# Altium project Kasli-SOC.PrjPcb (part 6 of 11)

## Sheet Kasli-SOC_ClockRecovery.SchDoc: Clock recovery
size 420 x 297 mm; EDA_Number: ARTIQ; Projet: ARTIQ/SINARA; CheckedBy: G.Kasprowicz; Author: F.Switakowski; CompanyName: WUT ISE; DrawnBy: F.Switakowski; Organization: WUT ISE; Address1: PW ISE; Address2: Nowowiejska 15/19 00-665 Warsaw; Address3: gkasprow@gmail.com; DocumentNumber: 12; Revision: 1; SheetNumber: 12; SheetTotal: 18; ModifiedBy: -; CheckedDate: -; Title2: & distribution; DivGrp: WUT ISE; Designer: G.Kasprowicz; ModifiedDate: -; ProjectName: Sensor Box
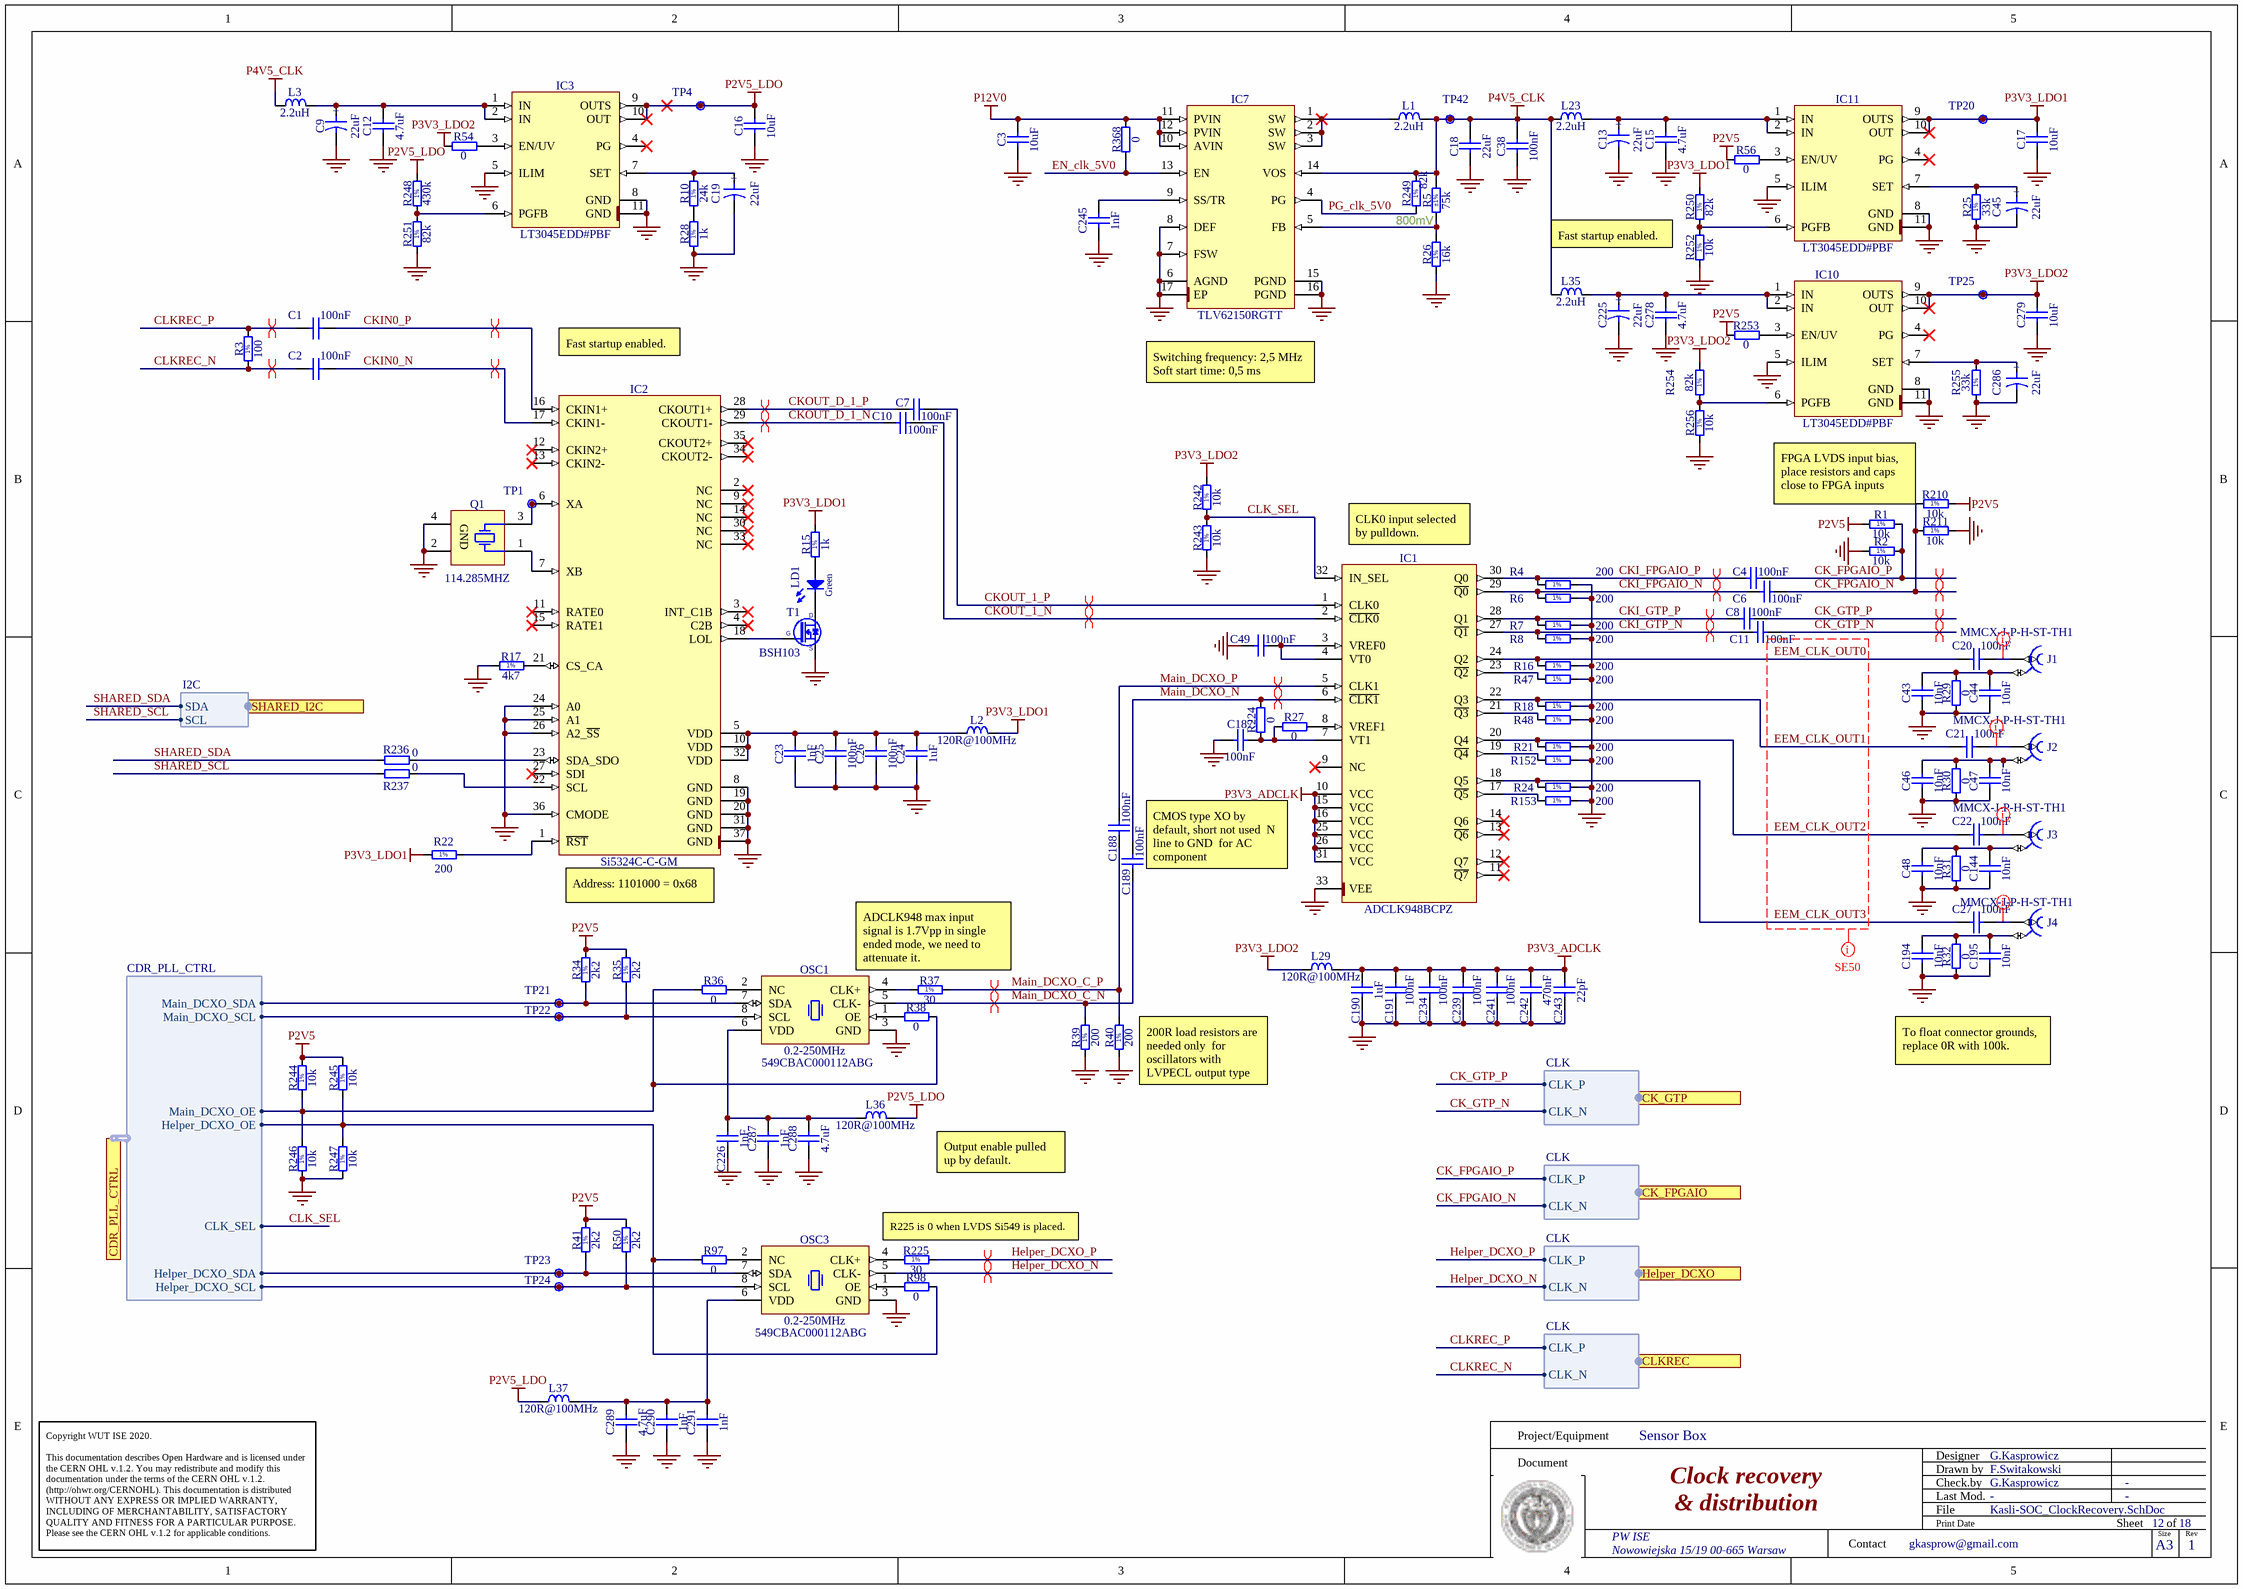
[diagram p11: Kasli-SOC_ClockRecovery.SchDoc]

### Parts
C1  100nF  [CAPC0603X33N]
C2  100nF  [CAPC0603X33N]
C3  10uF  [CAPC1608X80N]
C4  100nF  [CAPC0603X33N]
C6  100nF  [CAPC0603X33N]
C7  100nF  [CAPC0603X33N]
C8  100nF  [CAPC0603X33N]
C9  22uF  [CAPMP3216X180N]
C10  100nF  [CAPC0603X33N]
C11  100nF  [CAPC0603X33N]
C12  4.7uF  [CAPC1005X55N]
C13  22uF  [CAPMP3216X180N]
C15  4.7uF  [CAPC1005X55N]
C16  10uF  [CAPC1005X70N]
C17  10uF  [CAPC1005X70N]
C18  22uF  [CAPC2012X135N]
C19  22uF  [CAPMP3216X180N]
C20  100nF  [CAPC0603X33N]
C21  100nF  [CAPC0603X33N]
C22  100nF  [CAPC0603X33N]
C23  1nF  [CAPC1005X55N]
C24  1uF  [CAPC1005X55N]
C25  100nF  [CAPC1005X55N]
C26  100nF  [CAPC1005X55N]
C27  100nF  [CAPC0603X33N]
C38  100nF  [CAPC1005X55N]
C43  10nF  [CAPC1005X55N]
C44  10nF  [CAPC1005X55N]
C45  22uF  [CAPMP3216X180N]
C46  10nF  [CAPC1005X55N]
C47  10nF  [CAPC1005X55N]
C48  10nF  [CAPC1005X55N]
C49  100nF  [CAPC0603X33N]
C144  10nF  [CAPC1005X55N]
C187  100nF  [CAPC1005X55N]
C188  100nF  [CAPC0603X33N]
C189  100nF  [CAPC0603X33N]
C190  1uF  [CAPC1005X55N]
C191  100nF  [CAPC0603X33N]
C194  10nF  [CAPC1005X55N]
C195  10nF  [CAPC1005X55N]
C225  22uF  [CAPMP3216X180N]
C226  1nF  [CAPC1005X55N]
C234  100nF  [CAPC0603X33N]
C239  100nF  [CAPC0603X33N]
C241  100nF  [CAPC0603X33N]
C242  470nF  [CAPC0603X33N]
C243  22pF  [CAPC1005X55N]
C245  1nF  [CAPC1005X55N]
C278  4.7uF  [CAPC1005X55N]
C279  10uF  [CAPC1005X70N]
C286  22uF  [CAPMP3216X180N]
C287  1nF  [CAPC1005X55N]
C288  4.7uF  [CAPC2012X135N]
C289  4.7uF  [CAPC2012X135N]
C290  1nF  [CAPC1005X55N]
C291  1nF  [CAPC1005X55N]
IC1  ADCLK948BCPZ  [QFN50P500X500X80-33N-S285]
IC2  Si5324C-C-GM  [QFN50P600X600X90-37N-S425]
IC3  LT3045EDD#PBF  [SON50P300X300X80-11N-R175X248]
IC7  TLV62150RGTT  [QFN50P300X300X100-17N-S180]
IC10  LT3045EDD#PBF  [SON50P300X300X80-11N-R175X248]
IC11  LT3045EDD#PBF  [SON50P300X300X80-11N-R175X248]
J1  MMCX-J-P-H-ST-TH1  [SAMTEC_MMCX-J-P-H-ST-TH1]
J2  MMCX-J-P-H-ST-TH1  [SAMTEC_MMCX-J-P-H-ST-TH1]
J3  MMCX-J-P-H-ST-TH1  [SAMTEC_MMCX-J-P-H-ST-TH1]
J4  MMCX-J-P-H-ST-TH1  [SAMTEC_MMCX-J-P-H-ST-TH1]
L1  2.2uH  [IND_WURTH_WE-PMCI_0806LR]
L2  120R@100MHz  [INDC1608X65N]
L3  2.2uH  [IND_WURTH_WE-PMCI_0806LR]
L23  2.2uH  [IND_WURTH_WE-PMCI_0806LR]
L29  120R@100MHz  [INDC1608X65N]
L35  2.2uH  [IND_WURTH_WE-PMCI_0806LR]
L36  120R@100MHz  [INDC1608X65N]
L37  120R@100MHz  [INDC1608X65N]
LD1  Green  [LED_KINGBRIGHT_KPH-1608CGCK]
OSC1  0.2-250MHz  Manufacturer Part Number: 549CBAC000112ABG  [OSC_SILICON-LAB_SI549-A]
OSC3  0.2-250MHz  Manufacturer Part Number: 549CBAC000112ABG  [OSC_SILICON-LAB_SI549-A]
Q1  114.285MHZ  [XTAL_CONNOR_CS]
R1  10k  [RESC1005X40N]
R2  10k  [RESC1005X40N]
R3  100  [RESC1005X40N]
R4  200  [RESC1005X40N]
R5  75k  Tolerance: ±1%  [RESC1005X40N]
R6  200  [RESC1005X40N]
R7  200  [RESC1005X40N]
R8  200  [RESC1005X40N]
R10  24k  [RESC1005X40N]
R15  1k  [RESC1005X40N]
R16  200  [RESC1005X40N]
R17  4k7  [RESC1005X40N]
R18  200  [RESC1005X40N]
R21  200  [RESC1005X40N]
R22  200  [RESC1005X40N]
R24  200  [RESC1005X40N]
R25  33k  [RESC1005X40N]
R26  16k  [RESC1005X40N]
R27  0  [RESC1005X40N]
R28  1k  [RESC1005X40N]
R29  0  [RESC1005X40N]
R30  0  [RESC1005X40N]
R31  0  [RESC1005X40N]
R32  0  [RESC1005X40N]
R34  2k2  [RESC1005X40N]
R35  2k2  [RESC1005X40N]
R36  0  [RESC1005X40N]
R37  30  [RESC1005X40N]
R38  0  [RESC1005X40N]
R39  200  [RESC1005X40N]
R40  200  [RESC1005X40N]
R41  2k2  [RESC1005X40N]
R47  200  [RESC1005X40N]
R48  200  [RESC1005X40N]
R50  2k2  [RESC1005X40N]
R54  0  [RESC1005X40N]
R56  0  [RESC1005X40N]
R97  0  [RESC1005X40N]
R98  0  [RESC1005X40N]
R152  200  [RESC1005X40N]
R153  200  [RESC1005X40N]
R210  10k  [RESC1005X40N]
R211  10k  [RESC1005X40N]
R224  0  [RESC1005X40N]
R225  30  [RESC1005X40N]
R236  0  [RESC1005X40N]
R237  0  [RESC1005X40N]
R242  10k  [RESC1005X40N]
R243  10k  [RESC1005X40N]
R244  10k  [RESC1005X40N]
R245  10k  [RESC1005X40N]
R246  10k  [RESC1005X40N]
R247  10k  [RESC1005X40N]
R248  430k  [RESC1005X40N]
R249  82k  [RESC1005X40N]
R250  82k  [RESC1005X40N]
R251  82k  [RESC1005X40N]
R252  10k  [RESC1005X40N]
R253  0  [RESC1005X40N]
R254  82k  [RESC1005X40N]
R255  33k  [RESC1005X40N]
R256  10k  [RESC1005X40N]
R368  0  [RESC1005X40N]
T1  BSH103  [SOT95P230X110-3N]
TP1  Q1  [TPS127]  (value not drawn)  (no BOM)
TP4  P2V5 LDO  [TPS127]  (value not drawn)  (no BOM)
TP20  P2V5 LDO  [TPS127]  (value not drawn)  (no BOM)
TP21  I2C SW SDA  [TPS127]  (value not drawn)  (no BOM)
TP22  I2C SW SCL  [TPS127]  (value not drawn)  (no BOM)
TP23  I2C SW SDA  [TPS127]  (value not drawn)  (no BOM)
TP24  I2C SW SCL  [TPS127]  (value not drawn)  (no BOM)
TP25  P2V5 LDO  [TPS127]  (value not drawn)  (no BOM)
TP42  P2V5 LDO  [TPS127]  (value not drawn)  (no BOM)

### Ports
CDR_PLL_CTRL (harness CDR_PLL_CTRL), CK_FPGAIO (harness CLK), CK_GTP (harness CLK), CLKREC (harness CLK), Helper_DCXO (harness CLK), SHARED_I2C (harness I2C)

### Harnesses
CDR_PLL_CTRL: Main_DCXO_OE, Main_DCXO_SDA, Main_DCXO_SCL, Helper_DCXO_OE, Helper_DCXO_SDA, Helper_DCXO_SCL, CLK_SEL
CLK: CLK_P, CLK_N
I2C: SDA, SCL

### Nets
GND: C3.1 C9.2 C12.1 C13.2 C15.1 C16.1 C17.1 C18.1 C19.2 C23.1 C24.1 C25.1 C26.1 C38.1 C43.1 C44.1 C45.2 C46.1 C47.1 C48.1 C49.1 C144.1 C187.1 C190.1 C191.1 C194.1 C195.1 C225.2 C226.1 C234.1 C239.1 C241.1 C242.1 C243.1 C245.1 C278.1 C279.1 C286.2 C287.1 C288.1 C289.1 C290.1 C291.1 IC1.33(VEE) IC2.8(GND) IC2.19(GND) IC2.20(GND) IC2.24(A0) IC2.25(A1) IC2.26(A2_~{SS}) IC2.31(GND) IC2.36(CMODE) IC2.37(GND) IC3.5(ILIM) IC3.8(GND) IC3.11(GND) IC7.6(AGND) IC7.7(FSW) IC7.8(DEF) IC7.15(PGND) IC7.16(PGND) IC7.17(EP) IC10.5(ILIM) IC10.8(GND) IC10.11(GND) IC11.5(ILIM) IC11.8(GND) IC11.11(GND) OSC1.3(GND) OSC3.3(GND) Q1.2(GND) Q1.4(GND) R2.1 R4.2 R6.2 R7.2 R8.2 R16.2 R17.1 R18.2 R21.2 R24.2 R25.1 R26.1 R28.1 R29.1 R30.1 R31.1 R32.1 R39.1 R40.1 R47.2 R48.2 R152.2 R153.2 R211.1 R243.1 R246.1 R247.1 R251.1 R252.2 R255.1 R256.2 T1.2(S)
P2V5: R1.1 R34.2 R35.2 R41.2 R50.2 R56.1 R210.1 R244.2 R245.2 R253.1
P2V5_LDO: C16.2 IC3.9(OUTS) IC3.10(OUT) L36.1 L37.1 R248.2 TP4.1
P3V3_ADCLK: C190.2 C191.2 C234.2 C239.2 C241.2 C242.2 C243.2 IC1.10(VCC) IC1.15(VCC) IC1.16(VCC) IC1.25(VCC) IC1.26(VCC) IC1.31(VCC) L29.1
P3V3_LDO1: C17.2 IC11.9(OUTS) IC11.10(OUT) L2.2 R15.2 R22.1 R250.2 TP20.1
P3V3_LDO2: C279.2 IC10.9(OUTS) IC10.10(OUT) L29.2 R54.1 R242.2 R254.2 TP25.1
P4V5_CLK: C18.2 C38.2 IC7.14(VOS) L1.2 L3.1 L23.1 L35.1 R5.2 R249.2 TP42.1
P12V0: C3.2 IC7.10(AVIN) IC7.11(PVIN) IC7.12(PVIN) R368.2
CK_FPGAIO_N: C6.2 R210.2 R211.2 ; port CK_FPGAIO.CLK_N
CK_FPGAIO_P: C4.2 R1.2 R2.2 ; port CK_FPGAIO.CLK_P
CK_GTP_N: C11.2 ; port CK_GTP.CLK_N
CK_GTP_P: C8.2 ; port CK_GTP.CLK_P
CKI_FPGAIO_N: C6.1 IC1.29(~{Q0}) R6.1
CKI_FPGAIO_P: C4.1 IC1.30(Q0) R4.1
CKI_GTP_N: C11.1 IC1.27(~{Q1}) R8.1
CKI_GTP_P: C8.1 IC1.28(Q1) R7.1
CKIN0_N: C2.2 IC2.17(CKIN1-)
CKIN0_P: C1.2 IC2.16(CKIN1+)
CKOUT_1_N: C10.2 IC1.2(~{CLK0})
CKOUT_1_P: C7.2 IC1.1(CLK0)
CKOUT_D_1_N: C10.1 IC2.29(CKOUT1-)
CKOUT_D_1_P: C7.1 IC2.28(CKOUT1+)
CLK_SEL: IC1.32(IN_SEL) R242.1 R243.2 ; port CDR_PLL_CTRL.CLK_SEL
CLKREC_N: C2.1 R3.1 ; port CLKREC.CLK_N
CLKREC_P: C1.1 R3.2 ; port CLKREC.CLK_P
EEM_CLK_OUT0: C20.1 IC1.24(Q2) R16.1
EEM_CLK_OUT1: C21.1 IC1.22(Q3) R18.1
EEM_CLK_OUT2: C22.1 IC1.20(Q4) R21.1
EEM_CLK_OUT3: C27.1 IC1.18(Q5) R24.1
EN_clk_5V0: IC7.13(EN) R368.1
Helper_DCXO_N: OSC3.5(CLK-) ; port Helper_DCXO.CLK_N
Helper_DCXO_OE: R97.1 R98.2 R245.1 R247.2 ; port CDR_PLL_CTRL.Helper_DCXO_OE
Helper_DCXO_P: R225.2 ; port Helper_DCXO.CLK_P
Helper_DCXO_SCL: OSC3.8(SCL) R50.1 TP24.1 ; port CDR_PLL_CTRL.Helper_DCXO_SCL
Helper_DCXO_SDA: OSC3.7(SDA) R41.1 TP23.1 ; port CDR_PLL_CTRL.Helper_DCXO_SDA
Main_DCXO_C_N: C189.1 OSC1.5(CLK-) R39.2
Main_DCXO_C_P: C188.1 R37.2 R40.2
Main_DCXO_N: C189.2 IC1.6(~{CLK1}) R224.2
Main_DCXO_OE: R36.1 R38.2 R244.1 R246.2 ; port CDR_PLL_CTRL.Main_DCXO_OE
Main_DCXO_P: C188.2 IC1.5(CLK1)
Main_DCXO_SCL: OSC1.8(SCL) R35.1 TP22.1 ; port CDR_PLL_CTRL.Main_DCXO_SCL
Main_DCXO_SDA: OSC1.7(SDA) R34.1 TP21.1 ; port CDR_PLL_CTRL.Main_DCXO_SDA
PG_clk_5V0: IC7.4(PG) R249.1
SHARED_SCL: R237.1 ; port SHARED_I2C.SCL
SHARED_SDA: R236.1 ; port SHARED_I2C.SDA
NetC9_1: C9.1 C12.2 IC3.1(IN) IC3.2(IN) L3.2
NetC13_1: C13.1 C15.2 IC11.1(IN) IC11.2(IN) L23.2
NetC19_1: C19.1 IC3.7(SET) R10.2
NetC20_2: C20.2 J1.1
NetC21_2: C21.2 J2.1
NetC22_2: C22.2 J3.1
NetC23_2: C23.2 C24.2 C25.2 C26.2 IC2.5(VDD) IC2.10(VDD) IC2.32(VDD) L2.1
NetC27_2: C27.2 J4.1
NetC43_2: C43.2 C44.2 J1.2 R29.2
NetC45_1: C45.1 IC11.7(SET) R25.2
NetC46_2: C46.2 C47.2 J2.2 R30.2
NetC48_2: C48.2 C144.2 J3.2 R31.2
NetC49_2: C49.2 IC1.3(VREF0) IC1.4(VT0)
NetC187_2: C187.2 IC1.7(VT1) R27.1 R224.1
NetC194_2: C194.2 C195.2 J4.2 R32.2
NetC225_1: C225.1 C278.2 IC10.1(IN) IC10.2(IN) L35.2
NetC226_2: C226.2 C287.2 C288.2 L36.2 OSC1.6(VDD)
NetC245_2: C245.2 IC7.9(SS/TR)
NetC286_1: C286.1 IC10.7(SET) R255.2
NetC289_2: C289.2 C290.2 C291.2 L37.2 OSC3.6(VDD)
NetIC1_8: IC1.8(VREF1) R27.2
NetIC1_17: IC1.17(~{Q5}) R153.1
NetIC1_19: IC1.19(~{Q4}) R152.1
NetIC1_21: IC1.21(~{Q3}) R48.1
NetIC1_23: IC1.23(~{Q2}) R47.1
NetIC2_1: IC2.1(~{RST}) R22.2
NetIC2_6: IC2.6(XA) Q1.3(X) TP1.1
NetIC2_7: IC2.7(XB) Q1.1(X)
NetIC2_18: IC2.18(LOL) T1.1(G)
NetIC2_21: IC2.21(CS_CA) R17.2
NetIC2_22: IC2.22(SCL) R237.2
NetIC2_23: IC2.23(SDA_SDO) R236.2
NetIC3_3: IC3.3(EN/UV) R54.2
NetIC3_6: IC3.6(PGFB) R248.1 R251.2
NetIC7_1: IC7.1(SW) IC7.2(SW) IC7.3(SW) L1.1
NetIC7_5: IC7.5(FB) R5.1 R26.2
NetIC10_3: IC10.3(EN/UV) R253.2
NetIC10_6: IC10.6(PGFB) R254.1 R256.1
NetIC11_3: IC11.3(EN/UV) R56.2
NetIC11_6: IC11.6(PGFB) R250.1 R252.1
NetLD1_1: LD1.1(C) T1.3(D)
NetLD1_2: LD1.2(A) R15.1
NetOSC1_1: OSC1.1(OE) R38.1
NetOSC1_2: OSC1.2(NC) R36.2
NetOSC1_4: OSC1.4(CLK+) R37.1
NetOSC3_1: OSC3.1(OE) R98.1
NetOSC3_2: OSC3.2(NC) R97.2
NetOSC3_4: OSC3.4(CLK+) R225.1
NetR10_1: R10.1 R28.2

Not connected (* = marked no-connect by the designer): IC1 9(NC)* 11(~{Q7})* 12(Q7)* 13(~{Q6})* 14(Q6)*; IC2 2(NC)* 3(INT_C1B)* 4(C2B)* 9(NC)* 11(RATE0)* 12(CKIN2+)* 13(CKIN2-)* 14(NC)* 15(RATE1)* 27(SDI)* 30(NC)* 33(NC)* 34(CKOUT2-)* 35(CKOUT2+)*; IC3 4(PG)*; IC10 4(PG)*; IC11 4(PG)*

### Layout directives
differential pair; differential pair class LVPECL: CK_FPGAIO_N, CK_FPGAIO_P, CK_GTP_N, CK_GTP_P, CKI_FPGAIO_N, CKI_FPGAIO_P, CKI_GTP_N, CKI_GTP_P, CKOUT_1_N, CKOUT_1_P, CKOUT_D_1_N, CKOUT_D_1_P
differential pair; differential pair class Diff_100Ohm: CKIN0_N, CKIN0_P, CLKREC_N, CLKREC_P, Helper_DCXO_N, Helper_DCXO_P, Main_DCXO_C_N, Main_DCXO_C_P, Main_DCXO_N, Main_DCXO_P
net class SE50: EEM_CLK_OUT0, EEM_CLK_OUT1, EEM_CLK_OUT2, EEM_CLK_OUT3, NetC20_2, NetC21_2, NetC22_2, NetC27_2

### Notes on the sheet
- 800mV
- Fast startup enabled.
- (near IC7) Switching frequency: 2,5 MHz
  Soft start time: 0,5 ms
- (near R210) FPGA LVDS input bias, place resistors and caps close to FPGA inputs
- (near IC1) CLK0 input selected by pulldown.
- (near C189) CMOS type XO by  default, short not used  N line to GND  for AC component
- (near IC2) Address: 1101000 = 0x68
- ADCLK948 max input signal is 1.7Vpp in single  ended mode, we need to attenuate it.
- To float connector grounds, replace 0R with 100k.
- (near R40) 200R load resistors are needed only  for oscillators with  LVPECL output type
- (near L36) Output enable pulled up by default.
- R225 is 0 when LVDS Si549 is placed.
- Project/Equipment
- Document
- Designer
- Drawn by
- Check.by
- Copyright WUT ISE 2020.
  This documentation describes Open Hardware and is licensed under the CERN OHL v.1.2. You may redistribute and modify this documentation under the terms of the CERN OHL v.1.2. (http://ohwr.org/CERNOHL). This documentation is distributed WITHOUT ANY EXPRESS OR IMPLIED WARRANTY, INCLUDING OF MERCHANTABILITY, SATISFACTORY QUALITY AND FITNESS FOR A PARTICULAR PURPOSE. Please see the CERN OHL v.1.2 for applicable conditions.
- Contact
- File
- Last Mod.
- Print Date
- Sheet
- Size
- A3
- of
- Rev
- (in symbol CTE3216-18_22UF_6.3V_10%_LESR0900) +
- (in symbol R0402_1k_1%_0.0625W_100PPM) 1%
- (in symbol R0402_1K_1%_0.0625W_100PPM) 1%
- (in symbol R0402_2K2_1%_0.0625W_100PPM) 1%
- (in symbol R0402_4K7_1%_0.0625W_100PPM) 1%
- (in symbol R0402_10K_1%_0.0625W_100PPM) 1%
- (in symbol R0402_16K_1%_0.0625W_100PPM) 1%
- (in symbol R0402_24K_1%_0.0625W_100PPM) 1%
- (in symbol R0402_30R_1%_0.0625W_100PPM) 1%
- (in symbol R0402_33K_1%_0.0625W_100PPM) 1%
- (in symbol R0402_82K_1%_0.0625W_100PPM) 1%
- (in symbol R0402_100R_1%_0.0625W_100PPM) 1%
- (in symbol R0402_200R_1%_0.0625W_100PPM) 1%
- (in symbol R0402_430K_1%_0.0625W_100PPM) 1%

### Library data of the parts
C1 C2 C4 C6-C8 C10 C11 C20-C22 C27 C49 C188 C189 C191 C234 C239 C241 = CC0201_100NF_6.3V_10%_X5R: Non-polarised capacitor; Part Description: SMD Multilayer Chip Ceramic Capacitor; Manufacturer: GENERIC; Manufacturer1 Part Number: 02016D104KAT2A; Voltage: 6.3V; TC: X5R; Tolerance: ±10%; Part Number: CC0201_100NF_6.3V_10%_X5R; Component Kind: Standard; Component Type: Standard; Pin Count: 2; Value: 100nF; Status: Not Recommended; Manufacturer Part Number: CC0201_100NF_6.3V_10%_X5R; Case: 0201; Mounted: Yes; Socket: No; SMD: Yes; Sense: No; Manufacturer1 Example: AVX; Manufacturer1 ComponentHeight: 0.33mm; HelpURL: \\cern.ch\dfs\Applications\Altium\Datasheets\CC0201_X5R_AVX.pdf; Author: CERN DEM JLC; CreateDate: 2007-12-03; LatestRevisionDate: 2007-12-03
C3 = CC0603_10UF_16V_20%_X5R: Non-polarised capacitor; Part Description: SMD Multilayer Chip Ceramic Capacitor; Manufacturer: GENERIC; Manufacturer1 Part Number: GRM188R61C106MA73D; Voltage: 16V; TC: X5R; Tolerance: ±20%; Part Number: CC0603_10UF_16V_20%_X5R; Component Kind: Standard; Component Type: Standard; Pin Count: 2; Value: 10uF; Status: None; Manufacturer Part Number: CC0603_10UF_16V_20%_X5R; Case: 0603; Mounted: Yes; Socket: No; SMD: Yes; Sense: No; Manufacturer1 Example: MURATA; Manufacturer1 ComponentHeight: 0.8mm; HelpURL: \\cern.ch\dfs\Applications\Altium\Datasheets\CC0603_X5R_MURATA_GRM.pdf; Author: CERN DEM MR; CreateDate: 02.03.2016; LatestRevisionDate: 02.03.2016
C9 C13 C19 C45 C225 C286 = CTE3216-18_22UF_6.3V_10%_LESR0900: Polarised capacitor; Part Description: Low ESR 0R9 Solid Tantalum Chip Capacitor; Manufacturer: GENERIC; Manufacturer1 Part Number: TPSA226K006R0900; Voltage: 6.3V; Tolerance: ±10%; Part Number: CTE3216-18_22UF_6.3V_10%_LESR0900; Component Kind: Standard; Component Type: Standard; Pin Count: 2; Value: 22uF; Status: Preferred; Manufacturer Part Number: CTE3216-18_22UF_6.3V_10%_LESR0900; Case: A; Mounted: Yes; Socket: No; SMD: Yes; Sense: No; Manufacturer1 Example: AVX; Manufacturer1 ComponentHeight: 1.8mm; HelpURL: \\cern.ch\dfs\Applications\Altium\Datasheets\CTE-LESR_AVX_TPS.pdf; Author: CERN DEM JLC; CreateDate: 05.05.2008; LatestRevisionDate: 20.01.2009
C12 C15 C278 = CC0402_4.7UF_6.3V_20%_X5R: Non-polarised capacitor; Part Description: SMD Multilayer Chip Ceramic Capacitor; Manufacturer: GENERIC; Manufacturer1 Part Number: C1005X5R0J475M050BC; Voltage: 6.3V; TC: X5R; Tolerance: ±20%; Part Number: CC0402_4.7UF_6.3V_20%_X5R; Component Kind: Standard; Component Type: Standard; Pin Count: 2; Value: 4.7uF; Status: Preferred; Manufacturer Part Number: CC0402_4.7UF_6.3V_20%_X5R; Case: 0402; Mounted: Yes; Socket: No; SMD: Yes; Sense: No; Manufacturer1 Example: TDK; Manufacturer1 ComponentHeight: 0.65mm; HelpURL: \\cern.ch\dfs\Applications\Altium\Datasheets\CC0402_X5R_TDK_C.pdf; Author: CERN DEM JLC; CreateDate: 03.03.2015; LatestRevisionDate: 03.03.2015
C16 C17 C279 = CC0402_10UF_6.3V_20%_X5R: Non-polarised capacitor; Part Description: SMD Multilayer Chip Ceramic Capacitor; Manufacturer: GENERIC; Manufacturer1 Part Number: C1005X5R0J106M050BC; Voltage: 6.3V; TC: X5R; Tolerance: ±10%; Part Number: CC0402_10UF_6.3V_20%_X5R; Component Kind: Standard; Component Type: Standard; Pin Count: 2; Value: 10uF; Status: Preferred; Manufacturer Part Number: CC0402_10UF_6.3V_20%_X5R; Case: 0402; Mounted: Yes; Socket: No; SMD: Yes; Sense: No; Manufacturer1 Example: TDK; Manufacturer1 ComponentHeight: 0.70mm; HelpURL: \\cern.ch\dfs\Applications\Altium\Datasheets\CC0402_X5R_TDK_C.pdf; Author: CERN DEM JLC; CreateDate: 07.01.2015; LatestRevisionDate: 07.01.2015
C18 = CC0805_22UF_16V_10%_X5R: Non-polarised capacitor; Manufacturer: GENERIC; Part Description: SMD Multilayer Chip Ceramic Capacitor; Manufacturer1 Part Number: C2012X5R1C226KT; Tolerance: ±10%; Voltage: 16V; TC: X5R; Manufacturer Part Number: CC0805_22UF_16V_10%_X5R; Part Number: CC0805_22UF_16V_10%_X5R; Value: 22uF; Component Kind: Standard; Component Type: Standard; Pin Count: 2; Status: Preferred; Case: 0805; Mounted: Yes; Socket: No; SMD: Yes; Sense: No; Manufacturer1 Example: TDK; Manufacturer1 ComponentHeight: 1.35mm; HelpURL: \\cern.ch\dfs\Applications\Altium\Datasheets\CC0805_X5R_TDK_C.pdf; Author: CERN DEM JLC; CreateDate: 25.10.2012; LatestRevisionDate: 25.10.2012
C23 C226 C245 C287 C290 C291 = CC0402_1NF_50V_10%_X7R: Non-polarised capacitor; Part Description: SMD Multilayer Chip Ceramic Capacitor; Manufacturer: GENERIC; Manufacturer1 Part Number: 223858715623; Voltage: 50V; TC: X7R; Tolerance: ±10%; Part Number: CC0402_1NF_50V_10%_X7R; Component Kind: Standard; Component Type: Standard; Pin Count: 2; Value: 1nF; Status: Not Recommended; Manufacturer Part Number: CC0402_1NF_50V_10%_X7R; Case: 0402; Mounted: Yes; Socket: No; SMD: Yes; Sense: No; Manufacturer1 Example: PHYCOMP; Manufacturer1 ComponentHeight: 0.55mm; HelpURL: \\cern.ch\dfs\Applications\Altium\Datasheets\CC0402_X7R_PHYCOMP.pdf; Author: CERN DEM JLC; CreateDate: 03.12.2007; LatestRevisionDate: 03.12.2007
C24 C190 = CC0402_1UF_16V_10%_X5R: Non-polarised capacitor; Part Description: SMD Multilayer Chip Ceramic Capacitor; Manufacturer: GENERIC; Manufacturer1 Part Number: C1005X5R1C105KT; Voltage: 16V; TC: X5R; Tolerance: ±10%; Part Number: CC0402_1UF_16V_10%_X5R; Component Kind: Standard; Component Type: Standard; Pin Count: 2; Value: 1uF; Status: Preferred; Manufacturer Part Number: CC0402_1UF_16V_10%_X5R; Case: 0402; Mounted: Yes; Socket: No; SMD: Yes; Sense: No; Manufacturer1 Example: TDK; Manufacturer1 ComponentHeight: 0.55mm; HelpURL: \\cern.ch\dfs\Applications\Altium\Datasheets\CC0402_X5R_TDK_C.pdf; Author: CERN DEM JLC; CreateDate: 2012-10-25; LatestRevisionDate: 2012-10-25
C25 C26 C38 C187 = CC0402_100NF_16V_10%_X7R: Non-polarised capacitor; Part Description: SMD Multilayer Chip Ceramic Capacitor; Manufacturer: GENERIC; Manufacturer1 Part Number: GRM155R71C104KA88D; Voltage: 16V; TC: X7R; Tolerance: ±10%; Part Number: CC0402_100NF_16V_10%_X7R; Component Kind: Standard; Component Type: Standard; Pin Count: 2; Value: 100nF; Status: Not Recommended; Manufacturer Part Number: CC0402_100NF_16V_10%_X7R; Case: 0402; Mounted: Yes; Socket: No; SMD: Yes; Sense: No; Manufacturer1 Example: MURATA; Manufacturer1 ComponentHeight: 0.55mm; HelpURL: \\cern.ch\dfs\Applications\Altium\Datasheets\CC0402_X7R_MURATA_GRM.pdf; Author: CERN DEM JLC
  C25 C26 C187: CreateDate: 05.12.2013; LatestRevisionDate: 03.12.2007
  C38: CreateDate: 05/12/2013; LatestRevisionDate: 03/12/2007
C43 C44 C46-C48 C144 C194 C195 = CC0402_10NF_16V_10%_X7R: Non-polarised capacitor; Part Description: SMD Multilayer Chip Ceramic Capacitor; Manufacturer: GENERIC; Manufacturer1 Part Number: 223878715636; Voltage: 16V; TC: X7R; Tolerance: ±10%; Part Number: CC0402_10NF_16V_10%_X7R; Component Kind: Standard; Component Type: Standard; Pin Count: 2; Value: 10nF; Status: Not Recommended; Manufacturer Part Number: CC0402_10NF_16V_10%_X7R; Case: 0402; Mounted: Yes; Socket: No; SMD: Yes; Sense: No; Manufacturer1 Example: PHYCOMP; Manufacturer1 ComponentHeight: 0.55mm; HelpURL: \\cern.ch\dfs\Applications\Altium\Datasheets\CC0402_X7R_PHYCOMP.pdf; Author: CERN DEM JLC; CreateDate: 03.12.2007; LatestRevisionDate: 03.12.2007
C242 = CC0201_470NF_4V_20%_X5R: Non-polarised capacitor; Part Description: SMD Multilayer Chip Ceramic Capacitor; Manufacturer: GENERIC; Manufacturer1 Part Number: AMK063BJ474MP-F; Voltage: 4V; TC: X5R; Tolerance: ±20%; Part Number: CC0201_470NF_4V_20%_X5R; Component Kind: Standard; Component Type: Standard; Pin Count: 2; Value: 470nF; Status: Not Recommended; Manufacturer Part Number: CC0201_470NF_4V_20%_X5R; Case: 0201; Mounted: Yes; Socket: No; SMD: Yes; Sense: No; Manufacturer1 Example: TAIYO YUDEN; Manufacturer1 ComponentHeight: 0.33mm; HelpURL: \\cern.ch\dfs\Applications\Altium\Datasheets\CC0201_X5R_TAIYO-YUDEN_STANDARD-CLASS2.pdf; Author: CERN DEM JLC; CreateDate: 27.05.2010; LatestRevisionDate: 27.05.2010
C243 = CC0402_22PF_50V_5%_C0G: Non-polarised capacitor; Part Description: SMD Multilayer Chip Ceramic Capacitor; Manufacturer: GENERIC; Manufacturer1 Part Number: C0402C220J5GACTU; Voltage: 50V; TC: C0G/NP0; Tolerance: ±5%; Part Number: CC0402_22PF_50V_5%_C0G; Component Kind: Standard; Component Type: Standard; Pin Count: 2; Value: 22pF; Status: Preferred; Manufacturer Part Number: CC0402_22PF_50V_5%_C0G; Case: 0402; Mounted: Yes; Socket: No; SMD: Yes; Sense: No; Manufacturer1 Example: KEMET; Manufacturer1 ComponentHeight: 0.55mm; HelpURL: \\cern.ch\dfs\Applications\Altium\Datasheets\CC0805_C0G_KEMET_(Commercial Grade).pdf; Author: CERN DEM JLC; CreateDate: 2007-12-03; LatestRevisionDate: 2007-12-03
C288 C289 = CC0805_4.7UF_10V_10%_X5R: Non-polarised capacitor; Part Description: SMD Multilayer Chip Ceramic Capacitor; Manufacturer: GENERIC; Manufacturer1 Part Number: 222224013672; Voltage: 10V; TC: X5R; Tolerance: ±10%; Part Number: CC0805_4.7UF_10V_10%_X5R; Component Kind: Standard; Component Type: Standard; Pin Count: 2; Value: 4.7uF; Status: Preferred; Manufacturer Part Number: CC0805_4.7UF_10V_10%_X5R; Case: 0805; Mounted: Yes; Socket: No; SMD: Yes; Sense: No; Manufacturer1 Example: PHYCOMP; Manufacturer1 ComponentHeight: 1.45mm; HelpURL: \\cern.ch\dfs\Applications\Altium\Datasheets\CC0805_X5R_PHYCOMP_HC.pdf; Author: CERN DEM JLC; CreateDate: 03.12.2007; LatestRevisionDate: 03.12.2007
IC1 = ADCLK948BCPZ: Two Selectable Inputs, 8 LVPECL Outputs, SiGe Clock Fanout Buffer; Manufacturer: ANALOG DEVICES; PressFit: No; Bonding: No; Part Number: ADCLK948BCPZ; Component Kind: Standard; Component Type: Standard; Device: ADCLK948BCPZ; PackageDescription: QFN, 0.50mm Pitch, Square; 8 Pin X 8 Pin, 5mm X 5mm X 1.00mm H body (w/thermal tab 2.85 X 2.85mm),  IPC Medium Density; Part Description: Two Selectable Inputs, 8 LVPECL Outputs, SiGe Clock Fanout Buffer; Manufacturer Part Number: ADCLK948BCPZ; Pin Count: 33; Case: QFN32; Mounted: Yes; Socket: No; SMD: Yes; Sense: No; ComponentHeight: 0.8mm; Author: CERN DEM MR; HelpURL: \\cern.ch\dfs\Applications\Altium\Datasheets\ADCLK948BCPZ.pdf; CreateDate: 2016-11-30; LatestRevisionDate: 2016-11-30
IC2 = Si5324C-C-GM: Any Frequency Precision Clock Multiplier/Jitter Attenuator; Manufacturer: SILICON LABS; PressFit: No; Bonding: No; Part Number: Si5324C-C-GM; Component Kind: Standard; Component Type: Standard; Device: Si5324C-C-GM; PackageDescription: QFN, 0.50mm Pitch, Square; 36 Pin, 6.00mm L X 6.00mm W X 0.90mm H Body (w/thermal tab 4.25m x 4.25mm), IPC Medium Density; Part Description: Any Frequency Precision Clock Multiplier/Jitter Attenuator; Manufacturer Part Number: Si5324C-C-GM; Pin Count: 37; Case: QFN36; Mounted: Yes; Socket: No; SMD: Yes; Sense: No; ComponentHeight: 0.9mm; HelpURL: \\cern.ch\dfs\Applications\Altium\Datasheets\Si5324C-C-GM.pdf; Author: CERN DEM JLC; CreateDate: 19.08.2013; LatestRevisionDate: 19.08.2013
IC3 IC10 IC11 = LT3045EDD#PBF: 20V, 500mA, Ultralow Noise, Ultrahigh PSRR Linear Regulator; Manufacturer: LINEAR TECHNOLOGY; PressFit: No; Bonding: No; Part Number: LT3045EDD#PBF; Component Kind: Standard; Component Type: Standard; Device: LT3045EDD#PBF; PackageDescription: SON, 0.50mm Pitch, 10-pin, 3.00mm W  X 3.00mm L X 0.80mm Height, (w/thermal tab 1.75 X 2.48 mm), IPC Medium Density; Part Description: 20V, 500mA, Ultralow Noise, Ultrahigh PSRR Linear Regulator; Manufacturer Part Number: LT3045EDD#PBF; Pin Count: 11; Case: SON10; Mounted: Yes; Socket: No; SMD: Yes; Sense: No; ComponentHeight: 0.8mm; HelpURL: \\cern.ch\dfs\Applications\Altium\Datasheets\LT3045EDD#PBF.pdf; Author: CERN DEM JLC; CreateDate: 07.12.2016; LatestRevisionDate: 07.12.2016
IC7 = TLV62150RGTT: 4-17V 1A Step-Down Converter with DCS-Control; Part Description: 4-17V to 0.9-5V, Iout (max), 1A Step-Down Converter with DCS-Control; Manufacturer: TEXAS INSTRUMENTS; PressFit: No; Bonding: No; Part Number: TLV62150RGTT; Component Kind: Standard; Component Type: Standard; Device: TLV62150RGTT; PackageDescription: QFN, 0.50mm Pitch, Square; 4 Pin X 4 Pin, 3mm X 3mm X 1.00mm H Body (w/thermal tab 1.80 X 1.80mm),  IPC Medium Density; Manufacturer Part Number: TLV62150RGTT; Pin Count: 17; Case: QFN16; Mounted: Yes; Socket: No; SMD: Yes; Sense: No; ComponentHeight: 1.0mm; HelpURL: \\cern.ch\dfs\Applications\Altium\Datasheets\TLV62150RGTT.pdf; Author: CERN DEM JLC; CreateDate: 20.01.2015; LatestRevisionDate: 20.01.2015
J1-J4 = SAMTEC_MMCX-J-P-H-ST-TH1: Part Description: Straight Through-hole 50 Ohm Micro Mini RF Jack, MMCX Series; Manufacturer: SAMTEC; PressFit: No; Part Number: SAMTEC_MMCX-J-P-H-ST-TH1; Component Kind: Standard; Component Type: Standard; Pin Count: 2; Mounted: Yes; Socket: No; Sense: No; SMD: No; Status: None; Manufacturer Part Number: MMCX-J-P-H-ST-TH1; ComponentHeight: 4.35mm; HelpURL: \\cern.ch\dfs\Applications\Altium\Datasheets\SAMTEC_MMCX-J-P-H-ST-TH1.pdf; Author: CERN DEM JLC; CreateDate: 05.12.2012; LatestRevisionDate: 05.12.2012
L1 = IND_2.2UH_20%_WURTH_WE-PMCI_74479276222C: Inductor; Manufacturer: WURTH ELEKTRONIK; Part Description: SMD Power Molded Chip  Inductor (WE-PMCI Series); Tolerance: ±20%; Power: 1.1A; Resistance: 0.112R; Manufacturer Part Number: 74479276222C; Part Number: IND_2.2UH_20%_WURTH_WE-PMCI_74479276222C; Value: 2.2uH; Component Kind: Standard; Component Type: Standard; Pin Count: 2; Status: None; Mounted: Yes; Socket: No; SMD: Yes; Sense: No; ComponentHeight: 1mm; HelpURL: \\cern.ch\dfs\Applications\Altium\Datasheets\IND_WURTH_WE-PMCI_74479276222C.pdf; Author: CERN DEM JLC; CreateDate: 20.10.2016; LatestRevisionDate: 20.10.2016; Case: 0806
L2 L29 L36 L37 = IND0603_MURATA_BLM18SG121TN1D: Inductor; Part Description: SMD EMIFIL Suppression Chip Ferrite Bead; Manufacturer: MURATA; Power: 3A; Resistance: 0.025R; Tolerance: ±25%; Part Number: IND0603_MURATA_BLM18SG121TN1D; Component Kind: Standard; Component Type: Standard; Pin Count: 2; Value: 120R@100MHz; Status: None; Manufacturer Part Number: BLM18SG121TN1D; Case: 0603; Mounted: Yes; Socket: No; SMD: Yes; Sense: No; ComponentHeight: 0.65mm; HelpURL: \\cern.ch\dfs\Applications\Altium\Datasheets\IND0603_MURATA_BLM18S.pdf; Author: CERN DEM JLC; CreateDate: 23.07.2014; LatestRevisionDate: 23.07.2014
L3 L23 L35 = IND_2.2UH_20%_WURTH_WE-PMCI_74479276222C: Inductor; Part Description: SMD Power Molded Chip  Inductor (WE-PMCI Series); Manufacturer: WURTH ELEKTRONIK; Power: 1.1A; Resistance: 0.112R; Tolerance: ±20%; Part Number: IND_2.2UH_20%_WURTH_WE-PMCI_74479276222C; Component Kind: Standard; Component Type: Standard; Pin Count: 2; Value: 2.2uH; Status: None; Manufacturer Part Number: 74479276222C; Case: 0806; Mounted: Yes; Socket: No; SMD: Yes; Sense: No; ComponentHeight: 1mm; HelpURL: \\cern.ch\dfs\Applications\Altium\Datasheets\IND_WURTH_WE-PMCI_74479276222C.pdf; Author: CERN DEM JLC; CreateDate: 20.10.2016; LatestRevisionDate: 20.10.2016
LD1 = LED_KINGBRIGHT_KPH-1608CGCK: LED Green 1C 2A; Part Description: SMD Green LED, Case 1.6mmX0.8mm(0603), 0.65mm Thickness; PressFit: No; Bonding: No; Manufacturer Part Number: KPH-1608CGCK; ComponentHeight: 0.65mm; HelpURL: \\cern.ch\dfs\Applications\Altium\Datasheets\LED_KINGBRIGHT_KPH-1608CGCK.pdf; Part Number: LED_KINGBRIGHT_KPH-1608CGCK; Component Kind: Standard; Component Type: Standard; Color: Green; PackageDescription: SMT Green LED, Case 0603, Body L 1.6 x W 0.8mm H 0.65mm; Manufacturer: KINGBRIGHT; Pin Count: 2; Mounted: Yes; Socket: No; SMD: Yes; Sense: No; Author: CERN DEM JLC; CreateDate: 03.07.2017; LatestRevisionDate: 03.07.2017
OSC1 OSC3 = OSC_0.2-250MHZ_SILICON-LAB_549CBAC000112ABG: Any-Rate I2C Programmable XO Oscillator Si549 Series; Manufacturer: SILICON LABS; Part Description: 0.2-250MHz, 1.8V/2.5V/3.3V ±10ppm CMOS , Any-Rate I2C Programmable XO Oscillator Si549 Series; PressFit: No; Bonding: No; Part Number: OSC_0.2-250MHZ_SILICON-LAB_549CBAC000112ABG; Value: 0.2-250MHz; Component Kind: Standard; Component Type: Standard; PackageDescription: Oscillator Si549 Series, 8 pins, 5x7mm; Pin Count: 8; Mounted: Yes; Socket: No; SMD: Yes; Sense: No; ComponentHeight: 1.33mm; HelpURL: \\cern.ch\dfs\Applications\Altium\Datasheets\OSC_SILICON-LAB_SI549.pdf; Author: CERN DEM BC; CreateDate: 25.10.2019; LatestRevisionDate: 25.10.2019
Q1 = XTAL_114.285MHZ_CONNOR_CS-023: Crystal 4 pins 1=XTAL Control 2=GND3=XTAL 4=GND; Part Description: ±20ppm 18pF -40°C to +85°C  4 Pins, 3.2x2.5X0.8mm, SMD Crystal Unit, CS-018 Series; Manufacturer: CONNOR-WINFIELD; Manufacturer Part Number: CS-023-114.285M; PressFit: No; Bonding: No; Part Number: XTAL_114.285MHZ_CONNOR_CS-023; Component Kind: Standard; Component Type: Standard; PackageDescription: 4 Pins, 2.5x3.2mm, SMD Sealing Crystal, CS Series; Value: 114.285MHZ; Pin Count: 4; Mounted: Yes; Socket: No; SMD: Yes; Sense: No; ComponentHeight: 0.8mm; HelpURL: \\cern.ch\dfs\Applications\Altium\Datasheets\XTAL_CONNOR_CS-023.pdf; Author: CERN DEM JLC; CreateDate: 2014-07-08; LatestRevisionDate: 2014-07-08
R1 R2 R210 R211 R242-R247 R252 R256 = R0402_10K_1%_0.0625W_100PPM: Resistor - 1%; Part Description: General Purpose Thick Film Chip Resistor; Manufacturer: GENERIC; Manufacturer1 Part Number: 232270671003L; TC: ±100ppm/°C; PressFit: No; Part Number: R0402_10K_1%_0.0625W_100PPM; Component Kind: Standard; Component Type: Standard; Pin Count: 2; Value: 10k; Status: Not Recommended; Power: 0.0625W; Tolerance: ±1%; Manufacturer Part Number: R0402_10K_1%_0.0625W_100PPM; Case: 0402; Mounted: Yes; Sense: No; Socket: No; SMD: Yes; Manufacturer1 Example: YAGEO PHYCOMP; Manufacturer1 ComponentHeight: 0.4mm; HelpURL: \\cern.ch\dfs\Applications\Altium\Datasheets\R0402_Phycomp_RC0402.pdf; Author: CERN DEM JLC; CreateDate: 03.12.2007; LatestRevisionDate: 17.10.2012
R3 = R0402_100R_1%_0.0625W_100PPM: Resistor - 1%; Part Description: General Purpose Thick Film Chip Resistor; Manufacturer: GENERIC; Manufacturer1 Part Number: 232270671001L; TC: ±100ppm/°C; PressFit: No; Part Number: R0402_100R_1%_0.0625W_100PPM; Component Kind: Standard; Component Type: Standard; Pin Count: 2; Value: 100; Status: Not Recommended; Power: 0.0625W; Tolerance: ±1%; Manufacturer Part Number: R0402_100R_1%_0.0625W_100PPM; Case: 0402; Mounted: Yes; Sense: No; Socket: No; SMD: Yes; Manufacturer1 Example: YAGEO PHYCOMP; Manufacturer1 ComponentHeight: 0.4mm; HelpURL: \\cern.ch\dfs\Applications\Altium\Datasheets\R0402_Phycomp_RC0402.pdf; Author: CERN DEM JLC; CreateDate: 03.12.2007; LatestRevisionDate: 17.10.2012
R4 R6-R8 R16 R18 R21 R22 R24 R39 R40 R47 R48 R152 R153 = R0402_200R_1%_0.0625W_100PPM: Resistor - 1%; Part Description: General Purpose Thick Film Chip Resistor; Manufacturer: GENERIC; Manufacturer1 Part Number: 232270672001L; TC: ±100ppm/°C; PressFit: No; Part Number: R0402_200R_1%_0.0625W_100PPM; Component Kind: Standard; Component Type: Standard; Pin Count: 2; Value: 200; Status: Not Recommended; Power: 0.0625W; Tolerance: ±1%; Manufacturer Part Number: R0402_200R_1%_0.0625W_100PPM; Case: 0402; Mounted: Yes; Sense: No; Socket: No; SMD: Yes; Manufacturer1 Example: YAGEO PHYCOMP; Manufacturer1 ComponentHeight: 0.4mm; HelpURL: \\cern.ch\dfs\Applications\Altium\Datasheets\R0402_Phycomp_RC0402.pdf; Author: CERN DEM JLC; CreateDate: 03.12.2007; LatestRevisionDate: 17.10.2012
R5 = R0402_75K_1%_0.0625W_100PPM: Resistor - 1%; Part Description: General Purpose Thick Film Chip Resistor; Manufacturer: GENERIC; Manufacturer1 Part Number: 232270677503L; TC: ±100ppm/°C; PressFit: No; Part Number: R0402_75K_1%_0.0625W_100PPM; Component Kind: Standard; Component Type: Standard; Pin Count: 2; Value: 75k; Status: Not Recommended; Power: 0.0625W; Manufacturer Part Number: R0402_75K_1%_0.0625W_100PPM; Case: 0402; Mounted: Yes; Sense: No; Socket: No; SMD: Yes; Manufacturer1 Example: YAGEO PHYCOMP; Manufacturer1 ComponentHeight: 0.4mm; HelpURL: \\cern.ch\dfs\Applications\Altium\Datasheets\R0402_Phycomp_RC0402.pdf; Author: CERN DEM JLC; CreateDate: 03.12.2007; LatestRevisionDate: 17.10.2012
R10 = R0402_24K_1%_0.0625W_100PPM: Resistor - 1%; Part Description: General Purpose Thick Film Chip Resistor; Manufacturer: GENERIC; Manufacturer1 Part Number: 232270672403L; TC: ±100ppm/°C; PressFit: No; Part Number: R0402_24K_1%_0.0625W_100PPM; Component Kind: Standard; Component Type: Standard; Pin Count: 2; Value: 24k; Status: Not Recommended; Power: 0.0625W; Tolerance: ±1%; Manufacturer Part Number: R0402_24K_1%_0.0625W_100PPM; Case: 0402; Mounted: Yes; Sense: No; Socket: No; SMD: Yes; Manufacturer1 Example: YAGEO PHYCOMP; Manufacturer1 ComponentHeight: 0.4mm; HelpURL: \\cern.ch\dfs\Applications\Altium\Datasheets\R0402_Phycomp_RC0402.pdf; Author: CERN DEM JLC; CreateDate: 03.12.2007; LatestRevisionDate: 17.10.2012
R15 = R0402_1k_1%_0.0625W_100PPM: Resistor - 1%; Part Description: General Purpose Thick Film Chip Resistor; Manufacturer: GENERIC; Manufacturer1 Part Number: 232270671002L; TC: ±100ppm/°C; PressFit: No; Part Number: R0402_1K_1%_0.0625W_100PPM; Component Kind: Standard; Component Type: Standard; Pin Count: 2; Value: 1k; Status: Not Recommended; Power: 0.0625W; Tolerance: ±1%; Manufacturer Part Number: R0402_1K_1%_0.0625W_100PPM; Case: 0402; Mounted: Yes; Sense: No; Socket: No; SMD: Yes; Manufacturer1 Example: YAGEO PHYCOMP; Manufacturer1 ComponentHeight: 0.4mm; HelpURL: \\cern.ch\dfs\Applications\Altium\Datasheets\R0402_Phycomp_RC0402.pdf; Author: CERN DEM JLC; CreateDate: 03.12.2007; LatestRevisionDate: 17.10.2012
R17 = R0402_4K7_1%_0.0625W_100PPM: Resistor - 1%; Part Description: General Purpose Thick Film Chip Resistor; Manufacturer: GENERIC; Manufacturer1 Part Number: 232270674702L; TC: ±100ppm/°C; PressFit: No; Part Number: R0402_4K7_1%_0.0625W_100PPM; Component Kind: Standard; Component Type: Standard; Pin Count: 2; Value: 4k7; Status: Not Recommended; Power: 0.0625W; Tolerance: ±1%; Manufacturer Part Number: R0402_4K7_1%_0.0625W_100PPM; Case: 0402; Mounted: Yes; Sense: No; Socket: No; SMD: Yes; Manufacturer1 Example: YAGEO PHYCOMP; Manufacturer1 ComponentHeight: 0.4mm; HelpURL: \\cern.ch\dfs\Applications\Altium\Datasheets\R0402_Phycomp_RC0402.pdf; Author: CERN DEM JLC; CreateDate: 03.12.2007; LatestRevisionDate: 17.10.2012
R25 R255 = R0402_33K_1%_0.0625W_100PPM: Resistor - 1%; Part Description: General Purpose Thick Film Chip Resistor; Manufacturer: GENERIC; Manufacturer1 Part Number: 232270673303L; TC: ±100ppm/°C; PressFit: No; Part Number: R0402_33K_1%_0.0625W_100PPM; Component Kind: Standard; Component Type: Standard; Pin Count: 2; Value: 33k; Status: Not Recommended; Power: 0.0625W; Tolerance: ±1%; Manufacturer Part Number: R0402_33K_1%_0.0625W_100PPM; Case: 0402; Mounted: Yes; Sense: No; Socket: No; SMD: Yes; Manufacturer1 Example: YAGEO PHYCOMP; Manufacturer1 ComponentHeight: 0.4mm; HelpURL: \\cern.ch\dfs\Applications\Altium\Datasheets\R0402_Phycomp_RC0402.pdf; Author: CERN DEM JLC; CreateDate: 12/3/2007; LatestRevisionDate: 10/17/2012
R26 = R0402_16K_1%_0.0625W_100PPM: Resistor - 1%; Part Description: General Purpose Thick Film Chip Resistor; Manufacturer: GENERIC; Manufacturer1 Part Number: 232270671603L; TC: ±100ppm/°C; PressFit: No; Part Number: R0402_16K_1%_0.0625W_100PPM; Component Kind: Standard; Component Type: Standard; Pin Count: 2; Value: 16k; Status: Not Recommended; Power: 0.0625W; Tolerance: ±1%; Manufacturer Part Number: R0402_16K_1%_0.0625W_100PPM; Case: 0402; Mounted: Yes; Sense: No; Socket: No; SMD: Yes; Manufacturer1 Example: YAGEO PHYCOMP; Manufacturer1 ComponentHeight: 0.4mm; HelpURL: \\cern.ch\dfs\Applications\Altium\Datasheets\R0402_Phycomp_RC0402.pdf; Author: CERN DEM JLC; CreateDate: 03.12.2007; LatestRevisionDate: 17.10.2012
R27 R29-R32 R36 R38 R54 R56 R97 R98 R224 R236 R237 R253 R368 = R0402_0R_JUMPER: Resistor; Part Description: 1A (0.05R Max DC Resistance) Zero Ohm Jumper; Manufacturer: GENERIC; Manufacturer1 Part Number: 232270591001L; PressFit: No; Part Number: R0402_0R_JUMPER; Component Kind: Standard; Component Type: Standard; Pin Count: 2; Value: 0; Status: Not Recommended; Manufacturer Part Number: R0402_0R_JUMPER; Case: 0402; Mounted: Yes; Sense: No; Socket: No; SMD: Yes; Manufacturer1 Example: YAGEO PHYCOMP; Manufacturer1 ComponentHeight: 0.4mm; HelpURL: \\cern.ch\dfs\Applications\Altium\Datasheets\R0402_Phycomp_RC0402.pdf; Author: CERN DEM JLC; CreateDate: 03.12.2007; LatestRevisionDate: 17.10.2012
R28 = R0402_1K_1%_0.0625W_100PPM: Resistor - 1%; Part Description: General Purpose Thick Film Chip Resistor; Manufacturer: GENERIC; Manufacturer1 Part Number: 232270671002L; TC: ±100ppm/°C; PressFit: No; Part Number: R0402_1K_1%_0.0625W_100PPM; Component Kind: Standard; Component Type: Standard; Pin Count: 2; Value: 1k; Status: Not Recommended; Power: 0.0625W; Tolerance: ±1%; Manufacturer Part Number: R0402_1K_1%_0.0625W_100PPM; Case: 0402; Mounted: Yes; Sense: No; Socket: No; SMD: Yes; Manufacturer1 Example: YAGEO PHYCOMP; Manufacturer1 ComponentHeight: 0.4mm; HelpURL: \\cern.ch\dfs\Applications\Altium\Datasheets\R0402_Phycomp_RC0402.pdf; Author: CERN DEM JLC; CreateDate: 03.12.2007; LatestRevisionDate: 17.10.2012
R34 R35 R41 R50 = R0402_2K2_1%_0.0625W_100PPM: Resistor - 1%; Part Description: General Purpose Thick Film Chip Resistor; Manufacturer: GENERIC; Manufacturer1 Part Number: 232270672202L; TC: ±100ppm/°C; PressFit: No; Part Number: R0402_2K2_1%_0.0625W_100PPM; Component Kind: Standard; Component Type: Standard; Pin Count: 2; Value: 2k2; Status: Not Recommended; Power: 0.0625W; Tolerance: ±1%; Manufacturer Part Number: R0402_2K2_1%_0.0625W_100PPM; Case: 0402; Mounted: Yes; Sense: No; Socket: No; SMD: Yes; Manufacturer1 Example: YAGEO PHYCOMP; Manufacturer1 ComponentHeight: 0.4mm; HelpURL: \\cern.ch\dfs\Applications\Altium\Datasheets\R0402_Phycomp_RC0402.pdf; Author: CERN DEM JLC; CreateDate: 03.12.2007; LatestRevisionDate: 17.10.2012
R37 R225 = R0402_30R_1%_0.0625W_100PPM: Resistor - 1%; Part Description: General Purpose Thick Film Chip Resistor; Manufacturer: GENERIC; Manufacturer1 Part Number: 232270673009L; TC: ±100ppm/°C; PressFit: No; Part Number: R0402_30R_1%_0.0625W_100PPM; Component Kind: Standard; Component Type: Standard; Pin Count: 2; Value: 30; Status: Not Recommended; Power: 0.0625W; Tolerance: ±1%; Manufacturer Part Number: R0402_30R_1%_0.0625W_100PPM; Case: 0402; Mounted: Yes; Socket: No; SMD: Yes; Manufacturer1 Example: YAGEO PHYCOMP; Manufacturer1 ComponentHeight: 0.4mm; HelpURL: \\cern.ch\dfs\Applications\Altium\Datasheets\R0402_Phycomp_RC0402.pdf; Author: CERN DEM JLC; CreateDate: 03.12.2007; LatestRevisionDate: 17.10.2012; Sense: No
R248 = R0402_430K_1%_0.0625W_100PPM: Resistor - 1%; Manufacturer: GENERIC; Part Description: General Purpose Thick Film Chip Resistor; Manufacturer1 Part Number: 232270674304L; TC: ±100ppm/°C; PressFit: No; Manufacturer Part Number: R0402_430K_1%_0.0625W_100PPM; Part Number: R0402_430K_1%_0.0625W_100PPM; Tolerance: ±1%; Value: 430k; Component Kind: Standard; Component Type: Standard; Pin Count: 2; Status: Not Recommended; Power: 0.0625W; Case: 0402; Mounted: Yes; Sense: No; Socket: No; SMD: Yes; Manufacturer1 Example: YAGEO PHYCOMP; Manufacturer1 ComponentHeight: 0.4mm; HelpURL: \\cern.ch\dfs\Applications\Altium\Datasheets\R0402_Phycomp_RC0402.pdf; Author: CERN DEM JLC; CreateDate: 03.12.2007; LatestRevisionDate: 17.10.2012
R249 R251 = R0402_82K_1%_0.0625W_100PPM: Resistor - 1%; Part Description: General Purpose Thick Film Chip Resistor; Manufacturer: GENERIC; Manufacturer1 Part Number: 232270678203L; TC: ±100ppm/°C; PressFit: No; Part Number: R0402_82K_1%_0.0625W_100PPM; Component Kind: Standard; Component Type: Standard; Pin Count: 2; Value: 82k; Status: Not Recommended; Power: 0.0625W; Tolerance: ±1%; Manufacturer Part Number: R0402_82K_1%_0.0625W_100PPM; Case: 0402; Mounted: Yes; Sense: No; Socket: No; SMD: Yes; Manufacturer1 Example: YAGEO PHYCOMP; Manufacturer1 ComponentHeight: 0.4mm; HelpURL: \\cern.ch\dfs\Applications\Altium\Datasheets\R0402_Phycomp_RC0402.pdf; Author: CERN DEM JLC; CreateDate: 03.12.2007; LatestRevisionDate: 17.10.2012
R250 R254 = R0402_82K_1%_0.0625W_100PPM: Resistor - 1%; Manufacturer: GENERIC; Part Description: General Purpose Thick Film Chip Resistor; Manufacturer1 Part Number: 232270678203L; TC: ±100ppm/°C; PressFit: No; Manufacturer Part Number: R0402_82K_1%_0.0625W_100PPM; Part Number: R0402_82K_1%_0.0625W_100PPM; Tolerance: ±1%; Value: 82k; Component Kind: Standard; Component Type: Standard; Pin Count: 2; Status: Not Recommended; Power: 0.0625W; Case: 0402; Mounted: Yes; Sense: No; Socket: No; SMD: Yes; Manufacturer1 Example: YAGEO PHYCOMP; Manufacturer1 ComponentHeight: 0.4mm; HelpURL: \\cern.ch\dfs\Applications\Altium\Datasheets\R0402_Phycomp_RC0402.pdf; Author: CERN DEM JLC; CreateDate: 03.12.2007; LatestRevisionDate: 17.10.2012
T1 = BSH103: N-CHANNEL MOSFET WITH DIODE; Part Description: 30V 850mA N-Channel Enhancement Mode Field-Effect Transistor; Manufacturer: NEXPERIA; PressFit: No; Bonding: No; Part Number: BSH103; Component Kind: Standard; Component Type: Standard; Device: BSH103; PackageDescription: SOT23, 3 pin, Pitch 0.95mm - 1.3mm W X 2.9mm L X 1.1mm H, IPC Medium Density; Manufacturer Part Number: BSH103; Pin Count: 3; Case: SOT23-3; Mounted: Yes; Socket: No; SMD: Yes; Sense: No; ComponentHeight: 1.1mm; HelpURL: \\cern.ch\dfs\Applications\Altium\Datasheets\BSH103.pdf; Author: CERN DEM JLC; CreateDate: 16.03.2010; LatestRevisionDate: 20.06.2017
TP1 TP4 TP20-TP25 TP42 = SMD_PAD_1.27X1.27MM: Test Point; Part Description: 1.27mm x 1.27mm PCB Copper Area (SMD Test Point); Mounted: No; Part Number: SMD_PAD_1.27X1.27MM; Component Type: Standard (No BOM); Pin Count: 1; Family: Test Point; Socket: No; SMD: Yes; Sense: No; Status: None; ComponentHeight: 0mm; HelpURL: Undefined; Author: CERN DEM JLC; CreateDate: 12.01.2008; LatestRevisionDate: 12.01.2008; PackageDescription: 1.27mm x 1.27mm PCB Copper Area (SMD Test Point)